# EAGLE design protoplank (EAGLE 6.2)
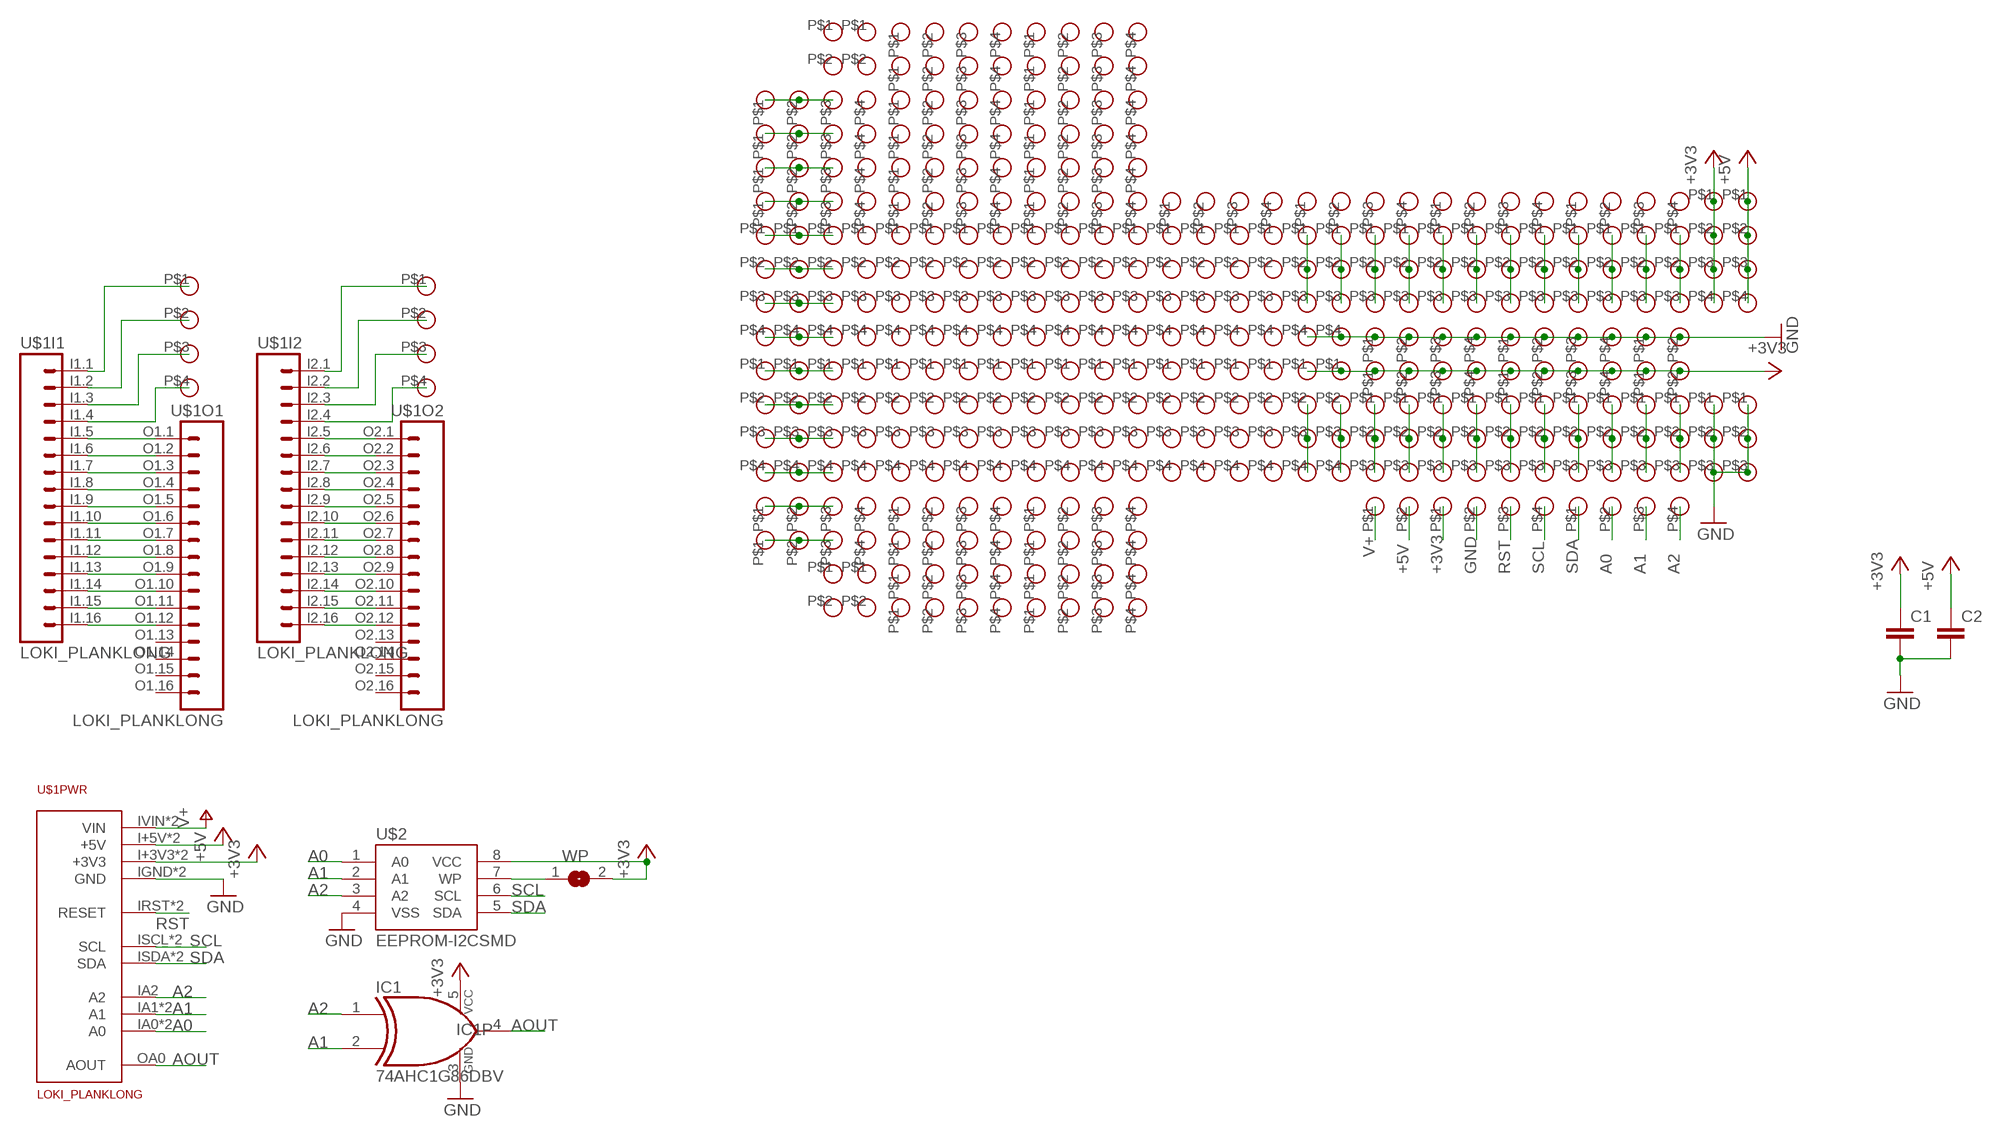
[diagram p0: schematic, sheet 1]

## Parts
C1  CAPPTH  [CAP-PTH-SMALL]
C2  CAPPTH  [CAP-PTH-SMALL]
IC1  74AHC1G86DBV  [SOT23-5]
U$1  LOKI_PLANKLONG  [PLANK_LONG]
U$2  EEPROM-I2CSMD  [SO08]
U$3  PROTOPAD-3  [PROTOPAD-3]
U$4  PROTOPAD-3  [PROTOPAD-3]
U$5  PROTOPAD-3  [PROTOPAD-3]
U$6  PROTOPAD-3  [PROTOPAD-3]
U$7  PROTOPAD-3  [PROTOPAD-3]
U$8  PROTOPAD-3  [PROTOPAD-3]
U$9  PROTOPAD-3  [PROTOPAD-3]
U$10  PROTOPAD-3  [PROTOPAD-3]
U$11  PROTOPAD-3  [PROTOPAD-3]
U$12  PROTOPAD-3  [PROTOPAD-3]
U$13  PROTOPAD-3  [PROTOPAD-3]
U$14  PROTOPAD-3  [PROTOPAD-3]
U$15  PROTOPAD-3  [PROTOPAD-3]
U$16  PROTOPAD-3  [PROTOPAD-3]
U$17  PROTOPAD-3  [PROTOPAD-3]
U$18  PROTOPAD-3  [PROTOPAD-3]
U$19  PROTOPAD-3  [PROTOPAD-3]
U$20  PROTOPAD-3  [PROTOPAD-3]
U$21  PROTOPAD-3  [PROTOPAD-3]
U$22  PROTOPAD-3  [PROTOPAD-3]
U$23  PROTOPAD-4SQUARE  [PROTOPAD-4]
U$24  PROTOPAD-4SQUARE  [PROTOPAD-4]
U$25  PROTOPAD-4SQUARE  [PROTOPAD-4]
U$26  PROTOPAD-4SQUARE  [PROTOPAD-4]
U$27  PROTOPAD-2SQUARE  [PROTOPAD-2]
U$28  PROTOPAD-2SQUARE  [PROTOPAD-2]
U$29  PROTOPAD-4ROUND  [PROTOPAD-4-ROUND]
U$30  PROTOPAD-4ROUND  [PROTOPAD-4-ROUND]
U$31  PROTOPAD-4ROUND  [PROTOPAD-4-ROUND]
U$32  PROTOPAD-4ROUND  [PROTOPAD-4-ROUND]
U$33  PROTOPAD-2ROUND  [PROTOPAD-2-ROUND]
U$34  PROTOPAD-4SQUARE  [PROTOPAD-4]
U$35  PROTOPAD-4SQUARE  [PROTOPAD-4]
U$36  PROTOPAD-4SQUARE  [PROTOPAD-4]
U$37  PROTOPAD-4SQUARE  [PROTOPAD-4]
U$38  PROTOPAD-4SQUARE  [PROTOPAD-4]
U$39  PROTOPAD-4SQUARE  [PROTOPAD-4]
U$40  PROTOPAD-4SQUARE  [PROTOPAD-4]
U$41  PROTOPAD-4SQUARE  [PROTOPAD-4]
U$42  PROTOPAD-4SQUARE  [PROTOPAD-4]
U$43  PROTOPAD-4SQUARE  [PROTOPAD-4]
U$44  PROTOPAD-4SQUARE  [PROTOPAD-4]
U$45  PROTOPAD-4SQUARE  [PROTOPAD-4]
U$46  PROTOPAD-4SQUARE  [PROTOPAD-4]
U$47  PROTOPAD-4SQUARE  [PROTOPAD-4]
U$48  PROTOPAD-4SQUARE  [PROTOPAD-4]
U$49  PROTOPAD-4SQUARE  [PROTOPAD-4]
U$50  PROTOPAD-4SQUARE  [PROTOPAD-4]
U$51  PROTOPAD-4SQUARE  [PROTOPAD-4]
U$52  PROTOPAD-4SQUARE  [PROTOPAD-4]
U$53  PROTOPAD-4SQUARE  [PROTOPAD-4]
U$54  PROTOPAD-4SQUARE  [PROTOPAD-4]
U$55  PROTOPAD-4SQUARE  [PROTOPAD-4]
U$56  PROTOPAD-4SQUARE  [PROTOPAD-4]
U$57  PROTOPAD-4SQUARE  [PROTOPAD-4]
U$58  PROTOPAD-4SQUARE  [PROTOPAD-4]
U$59  PROTOPAD-4SQUARE  [PROTOPAD-4]
U$60  PROTOPAD-4SQUARE  [PROTOPAD-4]
U$61  PROTOPAD-4SQUARE  [PROTOPAD-4]
U$62  PROTOPAD-4SQUARE  [PROTOPAD-4]
U$63  PROTOPAD-4SQUARE  [PROTOPAD-4]
U$64  PROTOPAD-4SQUARE  [PROTOPAD-4]
U$65  PROTOPAD-4SQUARE  [PROTOPAD-4]
U$66  PROTOPAD-4SQUARE  [PROTOPAD-4]
U$67  PROTOPAD-4SQUARE  [PROTOPAD-4]
U$68  PROTOPAD-4SQUARE  [PROTOPAD-4]
U$69  PROTOPAD-4SQUARE  [PROTOPAD-4]
U$70  PROTOPAD-4SQUARE  [PROTOPAD-4]
U$71  PROTOPAD-4SQUARE  [PROTOPAD-4]
U$72  PROTOPAD-4SQUARE  [PROTOPAD-4]
U$73  PROTOPAD-4SQUARE  [PROTOPAD-4]
U$74  PROTOPAD-4SQUARE  [PROTOPAD-4]
U$75  PROTOPAD-4SQUARE  [PROTOPAD-4]
U$76  PROTOPAD-4SQUARE  [PROTOPAD-4]
U$77  PROTOPAD-4SQUARE  [PROTOPAD-4]
U$78  PROTOPAD-3  [PROTOPAD-3]
U$79  PROTOPAD-4SQUARE  [PROTOPAD-4]
U$80  PROTOPAD-3  [PROTOPAD-3]
U$81  PROTOPAD-4SQUARE  [PROTOPAD-4]
U$82  PROTOPAD-4SQUARE  [PROTOPAD-4]
U$83  PROTOPAD-4SQUARE  [PROTOPAD-4]
U$84  PROTOPAD-4SQUARE  [PROTOPAD-4]
U$85  PROTOPAD-4SQUARE  [PROTOPAD-4]
U$86  PROTOPAD-4SQUARE  [PROTOPAD-4]
U$87  PROTOPAD-4SQUARE  [PROTOPAD-4]
U$88  PROTOPAD-4SQUARE  [PROTOPAD-4]
U$89  PROTOPAD-4SQUARE  [PROTOPAD-4]
U$90  PROTOPAD-4SQUARE  [PROTOPAD-4]
U$91  PROTOPAD-4SQUARE  [PROTOPAD-4]
U$92  PROTOPAD-4SQUARE  [PROTOPAD-4]
U$93  PROTOPAD-4SQUARE  [PROTOPAD-4]
U$94  PROTOPAD-4SQUARE  [PROTOPAD-4]
U$95  PROTOPAD-4SQUARE  [PROTOPAD-4]
U$96  PROTOPAD-4SQUARE  [PROTOPAD-4]
U$97  PROTOPAD-4SQUARE  [PROTOPAD-4]
U$98  PROTOPAD-4SQUARE  [PROTOPAD-4]
U$99  PROTOPAD-4SQUARE  [PROTOPAD-4]
U$100  PROTOPAD-4SQUARE  [PROTOPAD-4]
U$101  PROTOPAD-4SQUARE  [PROTOPAD-4]
U$102  PROTOPAD-4SQUARE  [PROTOPAD-4]
U$103  PROTOPAD-4SQUARE  [PROTOPAD-4]
U$104  PROTOPAD-2SQUARE  [PROTOPAD-2]
U$105  PROTOPAD-2SQUARE  [PROTOPAD-2]
U$106  PROTOPAD-2SQUARE  [PROTOPAD-2]
U$107  PROTOPAD-2SQUARE  [PROTOPAD-2]
WP  SJ  [SJ]

## Nets
+3V3: C1.1 IC1.5(VCC) U$1.I+3V3(PWR:+3V3) U$1.O+3V3(PWR:+3V3) U$2.8(VCC) U$25.P$1 U$25.P$2 U$25.P$3 U$25.P$4 U$26.P$1 U$26.P$2 U$26.P$3 U$26.P$4 U$28.P$1 U$28.P$2 U$32.P$1 U$35.P$1 U$36.P$1 U$77.P$1 U$77.P$2 U$77.P$3 U$77.P$4 WP.2
+5V: C2.1 U$1.I+5V(PWR:+5V) U$1.O+5V(PWR:+5V) U$33.P$2 U$79.P$1 U$79.P$2 U$79.P$3 U$79.P$4
A0: U$1.IA0(PWR:A0) U$1.OA1(PWR:A0) U$2.1(A0) U$31.P$2
A1: IC1.2(I1) U$1.IA1(PWR:A1) U$1.OA2(PWR:A1) U$2.2(A1) U$31.P$3
A2: IC1.1(I0) U$1.IA2(PWR:A2) U$2.3(A2) U$31.P$4
AOUT: IC1.4(O) U$1.OA0(PWR:AOUT)
GND: C1.2 C2.2 IC1.3(GND) U$1.IGND(PWR:GND) U$1.OGND(PWR:GND) U$2.4(VSS) U$23.P$1 U$23.P$2 U$23.P$3 U$23.P$4 U$24.P$1 U$24.P$2 U$24.P$3 U$24.P$4 U$27.P$1 U$27.P$2 U$32.P$2 U$34.P$4 U$37.P$4 U$78.P$1 U$78.P$2 U$78.P$3 U$80.P$1 U$80.P$2 U$80.P$3
N$1: U$1.I1.16 U$1.O1.12
N$2: U$1.I1.15 U$1.O1.11
N$3: U$1.I1.14 U$1.O1.10
N$4: U$1.I1.13 U$1.O1.9
N$5: U$1.I1.12 U$1.O1.8
N$6: U$1.I1.11 U$1.O1.7
N$7: U$1.I1.10 U$1.O1.6
N$8: U$1.I1.9 U$1.O1.5
N$9: U$1.I1.8 U$1.O1.4
N$10: U$1.I1.7 U$1.O1.3
N$11: U$1.I1.6 U$1.O1.2
N$12: U$1.I1.5 U$1.O1.1
N$13: U$1.I2.16 U$1.O2.12
N$14: U$1.I2.15 U$1.O2.11
N$15: U$1.I2.14 U$1.O2.10
N$16: U$1.I2.13 U$1.O2.9
N$17: U$1.I2.12 U$1.O2.8
N$18: U$1.I2.11 U$1.O2.7
N$19: U$1.I2.10 U$1.O2.6
N$20: U$1.I2.9 U$1.O2.5
N$21: U$1.I2.8 U$1.O2.4
N$22: U$1.I2.7 U$1.O2.3
N$23: U$1.I2.6 U$1.O2.2
N$24: U$1.I2.5 U$1.O2.1
N$25: U$1.I1.4 U$29.P$4
N$26: U$1.I1.3 U$29.P$3
N$27: U$1.I1.2 U$29.P$2
N$28: U$1.I1.1 U$29.P$1
N$29: U$1.I2.4 U$30.P$4
N$30: U$1.I2.3 U$30.P$3
N$31: U$2.7(WP) WP.1
N$32: U$3.P$1 U$3.P$2 U$3.P$3
N$33: U$1.I2.2 U$30.P$2
N$34: U$1.I2.1 U$30.P$1
N$35: U$4.P$1 U$4.P$2 U$4.P$3
N$36: U$5.P$1 U$5.P$2 U$5.P$3
N$37: U$6.P$1 U$6.P$2 U$6.P$3
N$38: U$7.P$1 U$7.P$2 U$7.P$3
N$39: U$8.P$1 U$8.P$2 U$8.P$3
N$40: U$9.P$1 U$9.P$2 U$9.P$3
N$41: U$10.P$1 U$10.P$2 U$10.P$3
N$42: U$11.P$1 U$11.P$2 U$11.P$3
N$43: U$12.P$1 U$12.P$2 U$12.P$3
N$44: U$13.P$1 U$13.P$2 U$13.P$3
N$45: U$14.P$1 U$14.P$2 U$14.P$3
N$46: U$15.P$1 U$15.P$2 U$15.P$3
N$47: U$16.P$1 U$16.P$2 U$16.P$3
N$48: U$17.P$1 U$17.P$2 U$17.P$3
N$49: U$18.P$1 U$18.P$2 U$18.P$3
N$50: U$19.P$1 U$19.P$2 U$19.P$3
N$51: U$20.P$1 U$20.P$2 U$20.P$3
N$52: U$21.P$1 U$21.P$2 U$21.P$3
N$53: U$22.P$1 U$22.P$2 U$22.P$3
N$54: U$89.P$1 U$89.P$2 U$89.P$3
N$55: U$88.P$1 U$88.P$2 U$88.P$3
N$56: U$34.P$1 U$34.P$2 U$34.P$3
N$57: U$37.P$1 U$37.P$2 U$37.P$3
N$58: U$81.P$1 U$81.P$2 U$81.P$3
N$59: U$35.P$2 U$35.P$3 U$35.P$4
N$60: U$36.P$2 U$36.P$3 U$36.P$4
N$61: U$76.P$1 U$76.P$2 U$76.P$3
N$62: U$65.P$1 U$66.P$1 U$69.P$1
N$63: U$65.P$2 U$66.P$2 U$69.P$2
N$64: U$65.P$3 U$66.P$3 U$69.P$3
N$65: U$65.P$4 U$66.P$4 U$69.P$4
N$66: U$64.P$1 U$67.P$1 U$68.P$1
N$67: U$64.P$2 U$67.P$2 U$68.P$2
N$68: U$64.P$3 U$67.P$3 U$68.P$3
N$69: U$64.P$4 U$67.P$4 U$68.P$4
N$70: U$96.P$1 U$96.P$2 U$96.P$3
N$71: U$99.P$1 U$99.P$2 U$99.P$3
RST: U$1.IRST(PWR:RESET) U$1.ORST(PWR:RESET) U$32.P$3
SCL: U$1.ISCL(PWR:SCL) U$1.OSCL(PWR:SCL) U$2.6(SCL) U$32.P$4
SDA: U$1.ISDA(PWR:SDA) U$1.OSDA(PWR:SDA) U$2.5(SDA) U$31.P$1
V+: U$1.IVIN(PWR:VIN) U$1.OVIN(PWR:VIN) U$33.P$1
Unconnected: U$1.O1.13 U$1.O1.14 U$1.O1.15 U$1.O1.16 U$1.O2.13 U$1.O2.14 U$1.O2.15 U$1.O2.16 U$38.P$1 U$38.P$2 U$38.P$3 U$38.P$4 U$39.P$1 U$39.P$2 U$39.P$3 U$39.P$4 U$40.P$1 U$40.P$2 U$40.P$3 U$40.P$4 U$41.P$1 U$41.P$2 U$41.P$3 U$41.P$4 U$42.P$1 U$42.P$2 U$42.P$3 U$42.P$4 U$43.P$1 U$43.P$2 U$43.P$3 U$43.P$4 U$44.P$1 U$44.P$2 U$44.P$3 U$44.P$4 U$45.P$1 U$45.P$2 U$45.P$3 U$45.P$4 U$46.P$1 U$46.P$2 U$46.P$3 U$46.P$4 U$47.P$1 U$47.P$2 U$47.P$3 U$47.P$4 U$48.P$1 U$48.P$2 U$48.P$3 U$48.P$4 U$49.P$1 U$49.P$2 U$49.P$3 U$49.P$4 U$50.P$1 U$50.P$2 U$50.P$3 U$50.P$4 U$51.P$1 U$51.P$2 U$51.P$3 U$51.P$4 U$52.P$1 U$52.P$2 U$52.P$3 U$52.P$4 U$53.P$1 U$53.P$2 U$53.P$3 U$53.P$4 U$54.P$1 U$54.P$2 U$54.P$3 U$54.P$4 U$55.P$1 U$55.P$2 U$55.P$3 U$55.P$4 U$56.P$1 U$56.P$2 U$56.P$3 U$56.P$4 U$57.P$1 U$57.P$2 U$57.P$3 U$57.P$4 U$58.P$1 U$58.P$2 U$58.P$3 U$58.P$4 U$59.P$1 U$59.P$2 U$59.P$3 U$59.P$4 U$60.P$1 U$60.P$2 U$60.P$3 U$60.P$4 U$61.P$1 U$61.P$2 U$61.P$3 U$61.P$4 U$62.P$1 U$62.P$2 U$62.P$3 U$62.P$4 U$63.P$1 U$63.P$2 U$63.P$3 U$63.P$4 U$70.P$1 U$70.P$2 U$70.P$3 U$70.P$4 U$71.P$1 U$71.P$2 U$71.P$3 U$71.P$4 U$72.P$1 U$72.P$2 U$72.P$3 U$72.P$4 U$73.P$1 U$73.P$2 U$73.P$3 U$73.P$4 U$74.P$1 U$74.P$2 U$74.P$3 U$74.P$4 U$75.P$1 U$75.P$2 U$75.P$3 U$75.P$4 U$76.P$4 U$81.P$4 U$82.P$1 U$82.P$2 U$82.P$3 U$82.P$4 U$83.P$1 U$83.P$2 U$83.P$3 U$83.P$4 U$84.P$1 U$84.P$2 U$84.P$3 U$84.P$4 U$85.P$1 U$85.P$2 U$85.P$3 U$85.P$4 U$86.P$1 U$86.P$2 U$86.P$3 U$86.P$4 U$87.P$1 U$87.P$2 U$87.P$3 U$87.P$4 U$88.P$4 U$89.P$4 U$90.P$1 U$90.P$2 U$90.P$3 U$90.P$4 U$91.P$1 U$91.P$2 U$91.P$3 U$91.P$4 U$92.P$1 U$92.P$2 U$92.P$3 U$92.P$4 U$93.P$1 U$93.P$2 U$93.P$3 U$93.P$4 U$94.P$1 U$94.P$2 U$94.P$3 U$94.P$4 U$95.P$1 U$95.P$2 U$95.P$3 U$95.P$4 U$96.P$4 U$97.P$1 U$97.P$2 U$97.P$3 U$97.P$4 U$98.P$1 U$98.P$2 U$98.P$3 U$98.P$4 U$99.P$4 U$100.P$1 U$100.P$2 U$100.P$3 U$100.P$4 U$101.P$1 U$101.P$2 U$101.P$3 U$101.P$4 U$102.P$1 U$102.P$2 U$102.P$3 U$102.P$4 U$103.P$1 U$103.P$2 U$103.P$3 U$103.P$4 U$104.P$1 U$104.P$2 U$105.P$1 U$105.P$2 U$106.P$1 U$106.P$2 U$107.P$1 U$107.P$2

## Library data of the parts
C1 C2 = SparkFun-Passives:CAP: Capacitor Standard 0603 ceramic capacitor, and 0.1" leaded capacitor.
IC1 = 74xx-little-us:74*1G86: 2-input EXCLUSIV-OR gate
U$1 = loki:LOKI_PLANK
U$2 = SparkFun-DigitalIC:EEPROM-I2C: I2C EEPROM chips, 24LC256 (and others)
U$3-U$22 U$78 U$80 = nickparts:PROTOPAD-3
U$23-U$26 U$29-U$32 U$34-U$77 U$79 U$81-U$103 = nickparts:PROTOPAD-4
U$27 U$28 U$33 U$104-U$107 = nickparts:PROTOPAD-2
WP = jumper:SJ: SMD solder JUMPER

## Board
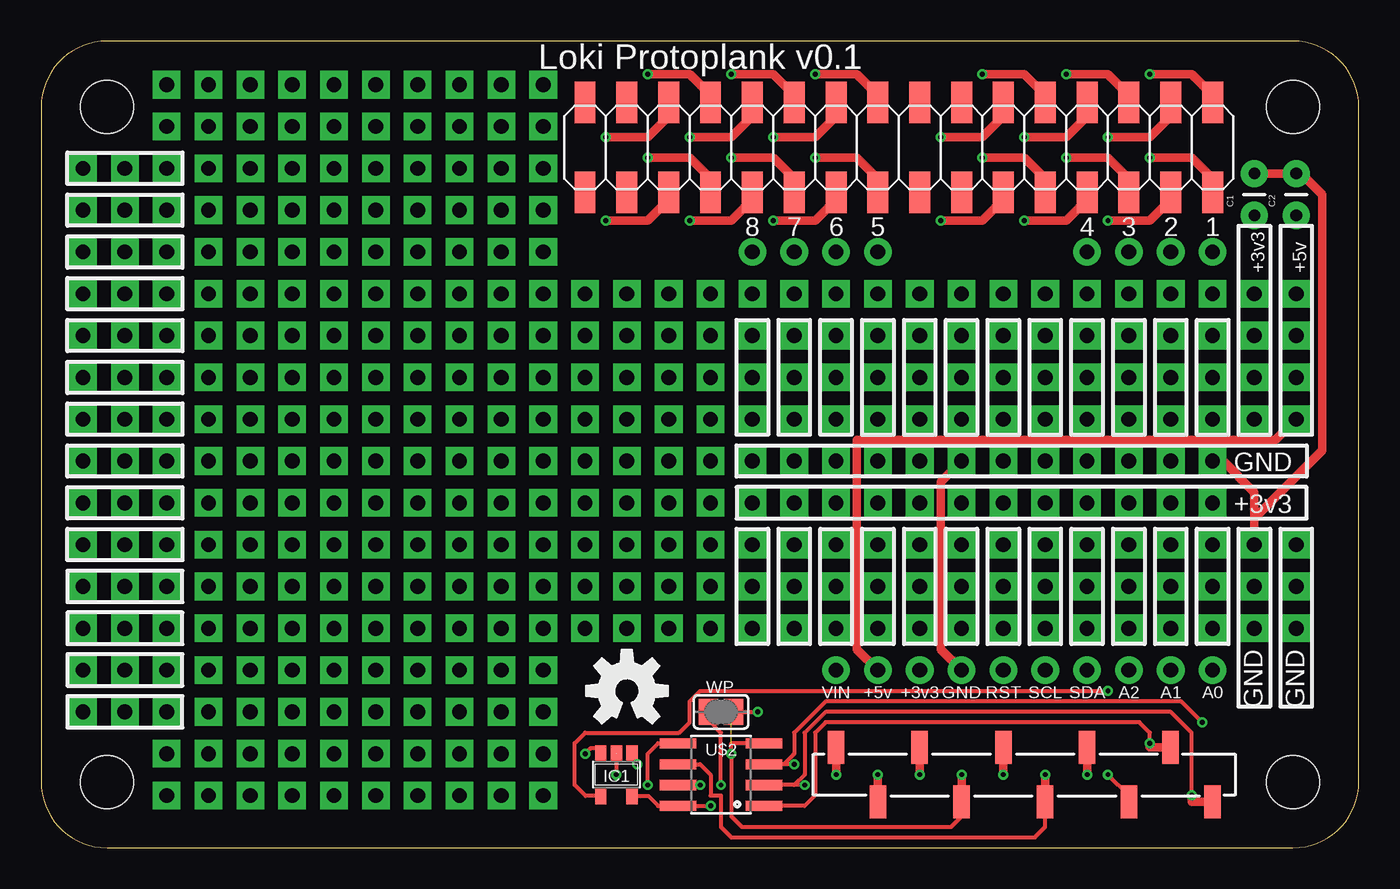
[diagram p1: board, top side]
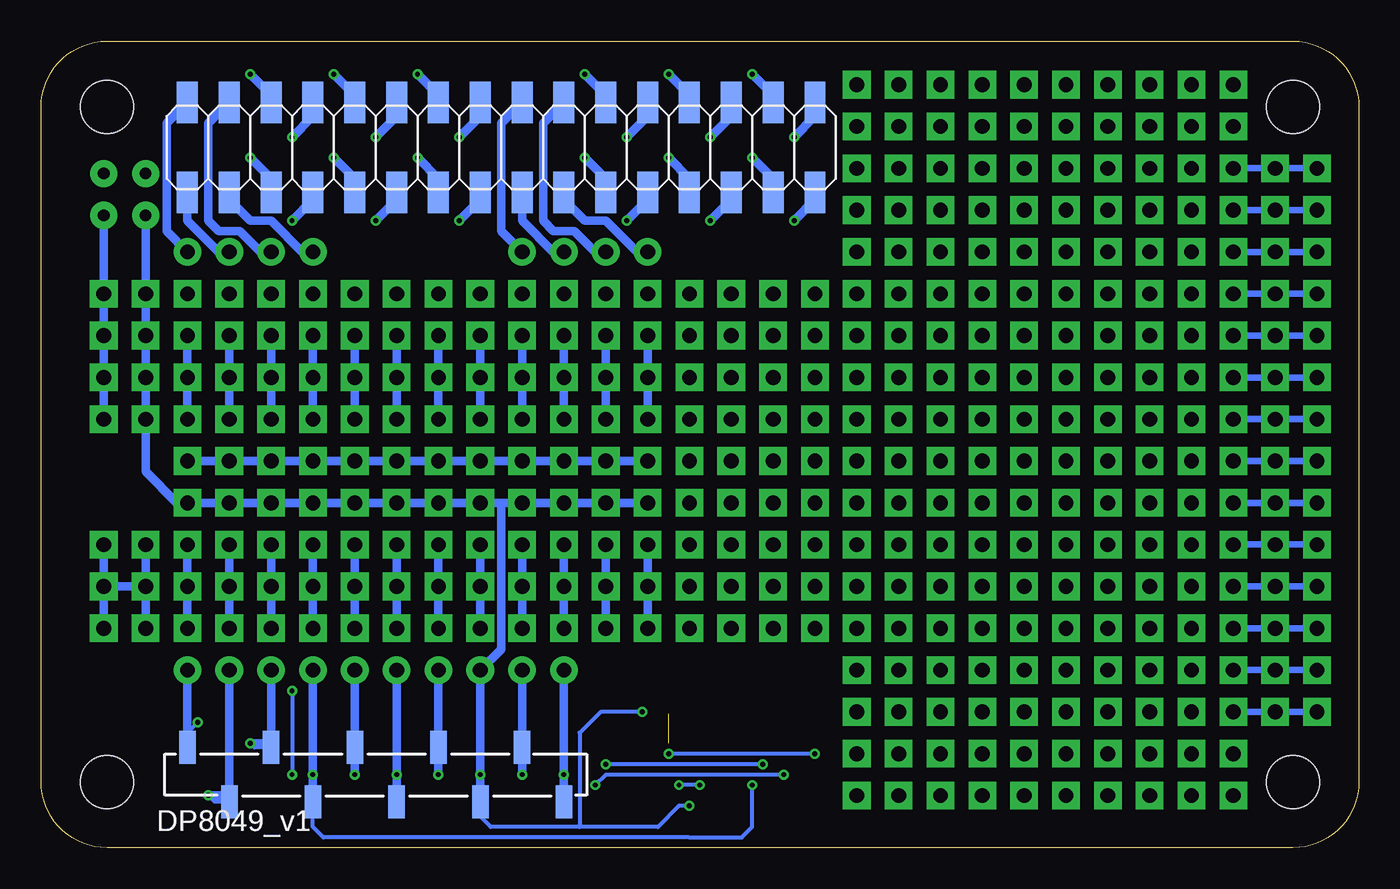
[diagram p2: board, bottom side, seen from below]

Size 80 x 49 mm. Coordinates in mm from the lower left corner, seen from the top.
Copper layers (1*16): Top 0.035mm / dielectric 1.5mm / Bottom 0.035mm
Design rules: minimum track width 6mil, minimum drill 0.3mm, track to track 6mil, track to pad 6mil, pad to pad 6mil, via to via 6mil, smd to smd 0mil, copper to edge 10mil, drill to drill 10mil, minimum pad ring 10mil, minimum via ring 6mil, stop-mask expansion 2mil, vias tented up to drill 100mil, thermal gap 10mil

### Footprints (pad centres in the part's own frame; a part is rotated, then mirrored left to right if it is on the bottom)
CAP-PTH-SMALL = drill 0.7 pad 1.651: 1 0,0; 2 2.54,0
SOT23-5 = smd 0.69 x 0.99: 1 -0.95,-1.29; 2 0,-1.29; 3 0.95,-1.29; 4 0.95,1.3; 5 -0.95,1.3
PLANK_LONG = smd 1.27 x 2.54 bottom: I1.1 71.12,45.275; I1.2 71.12,39.815; I1.3 68.58,45.275; I1.4 68.58,39.815; I1.5 66.04,45.275; I1.6 66.04,39.815; I1.7 63.5,45.275; I1.8 63.5,39.815; I1.9 60.96,45.275; I1.10 60.96,39.815; I1.11 58.42,45.275; I1.12 58.42,39.815; I1.13 55.88,45.275; I1.14 55.88,39.815; I1.15 53.34,45.275; I1.16 53.34,39.815; I2.1 50.8,45.275; I2.2 50.8,39.815; I2.3 48.26,45.275; I2.4 48.26,39.815; I2.5 45.72,45.275; I2.6 45.72,39.815; I2.7 43.18,45.275; I2.8 43.18,39.815; I2.9 40.64,45.275; I2.10 40.64,39.815; I2.11 38.1,45.275; I2.12 38.1,39.815; I2.13 35.56,45.275; I2.14 35.56,39.815; I2.15 33.02,45.275; I2.16 33.02,39.815 | smd 1 x 2 bottom: I+3V3 53.34,2.795; I+5V 50.8,6.095; IA0 66.04,6.095; IA1 68.58,2.795; IA2 71.12,6.095; IGND 55.88,6.095; IRST 58.42,2.795; ISCL 60.96,6.095; ISDA 63.5,2.795; IVIN 48.26,2.795 | smd 1.27 x 2.54: O1.1 71.12,45.275; O1.2 71.12,39.815; O1.3 68.58,45.275; O1.4 68.58,39.815; O1.5 66.04,45.275; O1.6 66.04,39.815; O1.7 63.5,45.275; O1.8 63.5,39.815; O1.9 60.96,45.275; O1.10 60.96,39.815; O1.11 58.42,45.275; O1.12 58.42,39.815; O1.13 55.88,45.275; O1.14 55.88,39.815; O1.15 53.34,45.275; O1.16 53.34,39.815; O2.1 50.8,45.275; O2.2 50.8,39.815; O2.3 48.26,45.275; O2.4 48.26,39.815; O2.5 45.72,45.275; O2.6 45.72,39.815; O2.7 43.18,45.275; O2.8 43.18,39.815; O2.9 40.64,45.275; O2.10 40.64,39.815; O2.11 38.1,45.275; O2.12 38.1,39.815; O2.13 35.56,45.275; O2.14 35.56,39.815; O2.15 33.02,45.275; O2.16 33.02,39.815 | smd 1 x 2: O+3V3 53.34,6.095; O+5V 50.8,2.795; OA0 66.04,2.795; OA1 68.58,6.095; OA2 71.12,2.795; OGND 55.88,2.795; ORST 58.42,6.095; OSCL 60.96,2.795; OSDA 63.5,6.095; OVIN 48.26,6.095 | hole 3.2: 4,4; 76,4; 76,45; 4,45
SO08 = smd 0.61 x 2.21: 1 -1.905,-2.616; 2 -0.635,-2.616; 3 0.635,-2.616; 4 1.905,-2.616; 5 1.905,2.616; 6 0.635,2.616; 7 -0.635,2.616; 8 -1.905,2.616
PROTOPAD-3 = drill 0.9 pad 1.676 square: P$1 0,2.54; P$2 0,0; P$3 0,-2.54
PROTOPAD-4 = drill 0.9 pad 1.676 square: P$1 0,3.81; P$2 0,1.27; P$3 0,-1.27; P$4 0,-3.81
PROTOPAD-2 = drill 0.9 pad 1.676 square: P$1 0,1.27; P$2 0,-1.27
PROTOPAD-4-ROUND = drill 0.9 pad 1.676: P$1 0,3.81; P$2 0,1.27; P$3 0,-1.27; P$4 0,-3.81
PROTOPAD-2-ROUND = drill 0.9 pad 1.676: P$1 0,1.27; P$2 0,-1.27
SJ = smd 1.168 x 1.6: 1 -0.762,0; 2 0.762,0

### Placement (x,y rotation side)
C1  73.66,38.42 90 top
C2  76.2,38.42 90 top
IC1  34.92,4.45 180 top
U$1  0,0 0 top
U$2  41.27,4.45 90 top
U$3  48.26,28.57 0 top
U$4  50.8,28.57 0 top
U$5  53.34,28.57 0 top
U$6  55.88,28.57 0 top
U$7  58.42,28.57 0 top
U$8  60.96,28.57 0 top
U$9  63.5,28.57 0 top
U$10  66.04,28.57 0 top
U$11  68.58,28.57 0 top
U$12  71.12,28.57 0 top
U$13  48.26,15.88 0 top
U$14  50.8,15.88 0 top
U$15  53.34,15.88 0 top
U$16  55.88,15.88 0 top
U$17  58.42,15.88 0 top
U$18  60.96,15.88 0 top
U$19  63.5,15.88 0 top
U$20  66.04,15.88 0 top
U$21  68.58,15.88 0 top
U$22  71.12,15.88 0 top
U$23  52.07,23.5 90 top
U$24  62.23,23.5 90 top
U$25  52.07,20.95 90 top
U$26  62.23,20.95 90 top
U$27  69.85,23.5 90 top
U$28  69.85,20.95 90 top
U$29  67.31,36.2 270 top
U$30  46.99,36.2 270 top
U$31  67.31,10.79 90 top
U$32  57.15,10.79 90 top
U$33  49.53,10.79 90 top
U$34  45.72,27.3 0 top
U$35  45.72,17.14 0 top
U$36  43.18,17.14 0 top
U$37  43.18,27.3 0 top
U$38  40.64,27.3 0 top
U$39  40.64,17.14 0 top
U$40  38.1,27.3 0 top
U$41  38.1,17.14 0 top
U$42  35.56,27.3 0 top
U$43  35.56,17.14 0 top
U$44  33.02,27.3 0 top
U$45  33.02,17.14 0 top
U$46  30.48,27.3 0 top
U$47  30.48,17.14 0 top
U$48  27.94,27.3 0 top
U$49  27.94,17.14 0 top
U$50  25.4,27.3 0 top
U$51  25.4,17.14 0 top
U$52  22.86,27.3 0 top
U$53  22.86,17.14 0 top
U$54  20.32,27.3 0 top
U$55  20.32,17.14 0 top
U$56  17.78,27.3 0 top
U$57  17.78,17.14 0 top
U$58  12.7,17.14 0 top
U$59  10.16,17.14 0 top
U$60  10.16,27.3 0 top
U$61  12.7,27.3 0 top
U$62  15.24,27.3 0 top
U$63  15.24,17.14 0 top
U$64  2.54,17.14 0 top
U$65  7.62,27.3 0 top
U$66  5.08,27.3 0 top
U$67  5.08,17.14 0 top
U$68  7.62,17.14 0 top
U$69  2.54,27.3 0 top
U$70  67.31,33.66 90 top
U$71  57.15,33.66 90 top
U$72  46.99,33.66 90 top
U$73  36.83,33.66 90 top
U$74  26.67,33.66 90 top
U$75  16.51,33.66 90 top
U$76  6.35,33.66 90 top
U$77  73.66,29.84 0 top
U$78  73.66,15.88 0 top
U$79  76.2,29.84 0 top
U$80  76.2,15.88 0 top
U$81  6.35,36.2 90 top
U$82  16.51,36.2 90 top
U$83  26.67,36.2 90 top
U$84  16.51,41.27 90 top
U$85  16.51,38.73 90 top
U$86  26.67,38.73 90 top
U$87  26.67,41.27 90 top
U$88  6.35,38.73 90 top
U$89  6.35,41.27 90 top
U$90  16.51,3.17 90 top
U$91  16.51,10.79 90 top
U$92  26.67,10.79 90 top
U$93  26.67,5.71 90 top
U$94  16.51,8.26 90 top
U$95  26.67,8.26 90 top
U$96  6.35,8.26 90 top
U$97  16.51,5.71 90 top
U$98  26.67,3.17 90 top
U$99  6.35,10.79 90 top
U$100  26.67,43.81 90 top
U$101  16.51,43.81 90 top
U$102  26.67,46.35 90 top
U$103  16.51,46.35 90 top
U$104  10.16,45.09 0 top
U$105  10.16,4.45 0 top
U$106  7.62,4.45 0 top
U$107  7.62,45.09 0 top
U$108  [OSHW-LOGO-M]  35.56,9.53 0 top
WP  41.27,8.26 0 top

### Tracks (layer width: path | path; a pad name or v marks a point on that pad's centre or on a via)
+3V3  (via drill 0.3)
  Top 0.254: v40.64,2.54 U$2.8 37.46,2.54 36.86,3.15 IC1.5 | WP.2 v43.5,8.26
  Top 0.508: U$1.O+3V3 v53.34,4.45
  Bottom 0.254: v40.64,2.54 41.27,2.54 42.54,1.27 47.31,1.27 | 47.31,1.27 52.7,1.27 53.34,1.91 U$1.I+3V3 | v43.5,8.26 46.04,8.26 47.31,6.99 47.31,1.27
  Bottom 0.508: v53.34,4.45 53.34,3.81 | 53.34,3.81 U$1.I+3V3 | 53.34,3.81 U$32.P$1 52.07,12.06 52.07,20.95 | 52.07,20.95 U$25.P$2 U$25.P$1 U$35.P$1 U$36.P$1 | 52.07,20.95 U$25.P$3 U$25.P$4 U$26.P$1 U$26.P$2 U$26.P$3 U$26.P$4 U$28.P$1 U$28.P$2 71.76,20.95 73.66,22.86 U$77.P$4 U$77.P$3 U$77.P$2 U$77.P$1 C1.1
+5V  (via drill 0.3)
  Top 0.508: v50.8,4.45 U$1.O+5V | U$79.P$4 74.93,24.77 50.16,24.77 49.53,24.77 49.53,24.13 49.53,12.06 U$33.P$2
  Bottom 0.508: U$1.I+5V 50.8,5.08 | 50.8,5.08 v50.8,4.45 | U$33.P$2 50.8,5.08 | U$79.P$4 U$79.P$3 U$79.P$2 U$79.P$1 C2.1
A0  (via drill 0.3)
  Top 0.254: v67.31,6.35 67.31,6.99 66.67,7.62 47.62,7.62 46.99,6.99 46.99,3.17 46.35,2.54 U$2.1
  Top 0.508: U$1.OA1 67.31,6.09 v67.31,6.35
  Bottom 0.254: U$1.IA0 67.06,6.09 v67.31,6.35
  Bottom 0.508: v67.31,6.35 66.04,6.35 U$1.IA0 U$31.P$2
A1  (via drill 0.3)
  Top 0.254: v69.85,3.17 69.85,6.99 68.58,8.26 47.62,8.26 46.35,6.99 46.35,4.45 45.72,3.81 U$2.2 v46.35,3.81 | IC1.2 v34.92,4.45
  Top 0.508: U$1.OA2 69.85,2.79 v69.85,3.17
  Bottom 0.254: U$1.IA1 69.47,2.79 v69.85,3.17 | v34.92,4.45 45.72,4.45 v46.35,3.81
  Bottom 0.508: v69.85,3.17 68.58,3.17 U$1.IA1 U$31.P$3
A2  (via drill 0.3)
  Top 0.254: v70.48,7.62 69.22,8.89 47.62,8.89 45.72,6.99 45.72,5.71 45.08,5.08 U$2.3 v45.72,5.08 | IC1.1 35.88,5.4 v36.2,5.08
  Bottom 0.254: U$1.IA2 71.12,6.35 71.12,6.99 v70.48,7.62 | v36.2,5.08 v45.72,5.08
  Bottom 0.508: U$31.P$4 U$1.IA2
AOUT  (via drill 0.3)
  Top 0.254: IC1.4 33.05,3.15 32.38,3.81 32.38,6.35 33.02,6.99 38.73,6.99 39.37,7.62 39.37,8.89 40,9.53 v64.77,9.53 | v64.77,4.45 66.04,3.17 U$1.OA0
  Bottom 0.254: v64.77,9.53 v64.77,4.45
GND  (via drill 0.3)  (1 unrouted)
  Top 0.254: v41.91,5.71 41.91,1.91 42.54,1.27 55.24,1.27 55.88,1.91 U$1.OGND | IC1.3 33.97,6.04 33.34,6.04 v33.02,5.71 | v41.91,5.71 41.91,6.35 | U$2.4 41.91,6.35 | v41.91,5.71 41.91,6.35
  Top 0.508: v55.88,4.45 U$1.OGND | U$32.P$2 54.61,12.06 54.61,22.23 U$23.P$4 | U$27.P$2 71.76,23.5 73.66,21.59 73.66,20 | 73.66,20 U$78.P$1 | 73.66,20 77.79,24.13 77.79,39.69 76.52,40.96 C2.2 C1.2
  Bottom 0.254: v33.02,5.71 v41.91,5.71
  Bottom 0.508: U$1.IGND 55.88,5.08 | 55.88,5.08 v55.88,4.45 | U$32.P$2 55.88,5.08 | U$27.P$2 U$27.P$1 U$24.P$4 U$24.P$3 U$24.P$2 U$24.P$1 U$23.P$4 U$23.P$3 U$23.P$2 U$23.P$1 U$34.P$4 U$37.P$4 | U$80.P$3 U$80.P$2 | U$80.P$2 U$80.P$1 | U$78.P$3 U$78.P$2 | U$78.P$2 U$78.P$1 | U$80.P$2 U$78.P$2
N$1  (via drill 0.3)
  Top 0.508: U$1.O1.12 58.42,39.37 57.15,38.1 v54.61,38.1
  Bottom 0.508: v54.61,38.1 53.34,39.37 U$1.I1.16
N$2  (via drill 0.3)
  Top 0.508: U$1.O1.11 58.42,44.45 57.15,43.18 v54.61,43.18
  Bottom 0.508: v54.61,43.18 53.34,44.45 U$1.I1.15
N$3  (via drill 0.3)
  Top 0.508: U$1.O1.10 60.96,40.64 59.69,41.91 v57.15,41.91
  Bottom 0.508: v57.15,41.91 55.88,40.64 U$1.I1.14
N$4  (via drill 0.3)
  Top 0.508: U$1.O1.9 60.96,45.72 59.69,46.99 v57.15,46.99
  Bottom 0.508: v57.15,46.99 55.88,45.72 U$1.I1.13
N$5  (via drill 0.3)
  Top 0.508: U$1.O1.8 63.5,39.37 62.23,38.1 v59.69,38.1
  Bottom 0.508: v59.69,38.1 58.42,39.37 U$1.I1.12
N$6  (via drill 0.3)
  Top 0.508: U$1.O1.7 63.5,44.45 62.23,43.18 v59.69,43.18
  Bottom 0.508: v59.69,43.18 58.42,44.45 U$1.I1.11
N$7  (via drill 0.3)
  Top 0.508: U$1.O1.6 66.04,40.64 64.77,41.91 v62.23,41.91
  Bottom 0.508: v62.23,41.91 60.96,40.64 U$1.I1.10
N$8  (via drill 0.3)
  Top 0.508: U$1.O1.5 66.04,45.72 64.77,46.99 v62.23,46.99
  Bottom 0.508: v62.23,46.99 60.96,45.72 U$1.I1.9
N$9  (via drill 0.3)
  Top 0.508: U$1.O1.4 68.58,39.37 67.31,38.1 v64.77,38.1
  Bottom 0.508: v64.77,38.1 63.5,39.37 U$1.I1.8
N$10  (via drill 0.3)
  Top 0.508: U$1.O1.3 68.58,44.45 67.31,43.18 v64.77,43.18
  Bottom 0.508: v64.77,43.18 63.5,44.45 U$1.I1.7
N$11  (via drill 0.3)
  Top 0.508: U$1.O1.2 71.12,40.64 69.85,41.91 v67.31,41.91
  Bottom 0.508: v67.31,41.91 66.04,40.64 U$1.I1.6
N$12  (via drill 0.3)
  Top 0.508: U$1.O1.1 71.12,45.72 69.85,46.99 v67.31,46.99
  Bottom 0.508: v67.31,46.99 66.04,45.72 U$1.I1.5
N$13  (via drill 0.3)
  Top 0.508: U$1.O2.12 38.1,39.37 36.83,38.1 v34.29,38.1
  Bottom 0.508: v34.29,38.1 33.02,39.37 U$1.I2.16
N$14  (via drill 0.3)
  Top 0.508: U$1.O2.11 38.1,44.45 36.83,43.18 v34.29,43.18
  Bottom 0.508: v34.29,43.18 33.02,44.45 U$1.I2.15
N$15  (via drill 0.3)
  Top 0.508: U$1.O2.10 40.64,40.64 39.37,41.91 v36.83,41.91
  Bottom 0.508: v36.83,41.91 35.56,40.64 U$1.I2.14
N$16  (via drill 0.3)
  Top 0.508: U$1.O2.9 40.64,45.72 39.37,46.99 v36.83,46.99
  Bottom 0.508: v36.83,46.99 35.56,45.72 U$1.I2.13
N$17  (via drill 0.3)
  Top 0.508: U$1.O2.8 43.18,39.37 41.91,38.1 v39.37,38.1
  Bottom 0.508: v39.37,38.1 38.1,39.37 U$1.I2.12
N$18  (via drill 0.3)
  Top 0.508: U$1.O2.7 43.18,44.45 41.91,43.18 v39.37,43.18
  Bottom 0.508: v39.37,43.18 38.1,44.45 U$1.I2.11
N$19  (via drill 0.3)
  Top 0.508: U$1.O2.6 45.72,40.64 44.45,41.91 v41.91,41.91
  Bottom 0.508: v41.91,41.91 40.64,40.64 U$1.I2.10
N$20  (via drill 0.3)
  Top 0.508: U$1.O2.5 45.72,45.72 44.45,46.99 v41.91,46.99
  Bottom 0.508: v41.91,46.99 40.64,45.72 U$1.I2.9
N$21  (via drill 0.3)
  Top 0.508: U$1.O2.4 48.26,39.37 46.99,38.1 v44.45,38.1
  Bottom 0.508: v44.45,38.1 43.18,39.37 U$1.I2.8
N$22  (via drill 0.3)
  Top 0.508: U$1.O2.3 48.26,44.45 46.99,43.18 v44.45,43.18
  Bottom 0.508: v44.45,43.18 43.18,44.45 U$1.I2.7
N$23  (via drill 0.3)
  Top 0.508: U$1.O2.2 50.8,40.64 49.53,41.91 v46.99,41.91
  Bottom 0.508: v46.99,41.91 45.72,40.64 U$1.I2.6
N$24  (via drill 0.3)
  Top 0.508: U$1.O2.1 50.8,45.72 49.53,46.99 v46.99,46.99
  Bottom 0.508: v46.99,46.99 45.72,45.72 U$1.I2.5
N$25
  Bottom 0.508: U$29.P$4 64.14,36.2 66.04,38.1 67.31,38.1 68.58,39.37 U$1.I1.4
N$26
  Bottom 0.508: U$29.P$3 66.67,36.2 67.95,37.47 69.22,37.47 69.85,38.1 69.85,44.01 U$1.I1.3
N$27
  Bottom 0.508: U$29.P$2 69.22,36.2 71.12,38.1 U$1.I1.2
N$28
  Bottom 0.508: U$29.P$1 72.39,37.47 72.39,44.01 U$1.I1.1
N$29
  Bottom 0.508: U$1.I2.4 48.26,39.37 46.99,38.1 45.72,38.1 43.81,36.2 U$30.P$4
N$30
  Bottom 0.508: U$30.P$3 46.35,36.2 47.62,37.47 48.89,37.47 49.53,38.1 49.53,44.01 U$1.I2.3
N$31  (via drill 0.3)
  Top 0.254: U$2.7 v40,3.81 | v41.27,3.81 41.27,6.99 40.64,7.62 40.64,8.13 WP.1
  Bottom 0.254: v40,3.81 v41.27,3.81
N$32
  Bottom 0.508: U$3.P$1 U$3.P$2 U$3.P$3
N$33
  Bottom 0.508: U$30.P$2 48.89,36.2 50.8,38.1 U$1.I2.2
N$34
  Bottom 0.508: U$30.P$1 52.07,37.47 52.07,44.01 U$1.I2.1
N$35
  Bottom 0.508: U$4.P$1 U$4.P$2 U$4.P$3
N$36
  Bottom 0.508: U$5.P$1 U$5.P$2 U$5.P$3
N$37
  Bottom 0.508: U$6.P$1 U$6.P$2 U$6.P$3
N$38
  Bottom 0.508: U$7.P$1 U$7.P$2 U$7.P$3
N$39
  Bottom 0.508: U$8.P$1 U$8.P$2 U$8.P$3
N$40
  Bottom 0.508: U$9.P$1 U$9.P$2 U$9.P$3
N$41
  Bottom 0.508: U$10.P$1 U$10.P$2 U$10.P$3
N$42
  Bottom 0.508: U$11.P$1 U$11.P$2 U$11.P$3
N$43
  Bottom 0.508: U$12.P$1 U$12.P$2 U$12.P$3
N$44
  Bottom 0.508: U$13.P$1 U$13.P$2 U$13.P$3
N$45
  Bottom 0.508: U$14.P$1 U$14.P$2 U$14.P$3
N$46
  Bottom 0.508: U$15.P$1 U$15.P$2 U$15.P$3
N$47
  Bottom 0.508: U$16.P$1 U$16.P$2 U$16.P$3
N$48
  Bottom 0.508: U$17.P$1 U$17.P$2 U$17.P$3
N$49
  Bottom 0.508: U$18.P$1 U$18.P$2 U$18.P$3
N$50
  Bottom 0.508: U$19.P$1 U$19.P$2 U$19.P$3
N$51
  Bottom 0.508: U$20.P$1 U$20.P$2 U$20.P$3
N$52
  Bottom 0.508: U$21.P$1 U$21.P$2 U$21.P$3
N$53
  Bottom 0.508: U$22.P$1 U$22.P$2 U$22.P$3
N$54
  Bottom 0.406: U$89.P$1 U$89.P$2 U$89.P$3
N$55
  Bottom 0.406: U$88.P$3 U$88.P$2 U$88.P$1
N$56
  Bottom 0.508: U$34.P$3 U$34.P$2 U$34.P$1
N$57
  Bottom 0.508: U$37.P$1 U$37.P$2 U$37.P$3
N$58
  Bottom 0.406: U$81.P$1 U$81.P$2 U$81.P$3
N$59
  Bottom 0.508: U$35.P$2 U$35.P$3 U$35.P$4
N$60
  Bottom 0.508: U$36.P$4 U$36.P$3 U$36.P$2
N$61
  Bottom 0.406: U$76.P$1 U$76.P$2 U$76.P$3
N$62
  Bottom 0.406: U$69.P$1 U$66.P$1 U$65.P$1
N$63
  Bottom 0.406: U$65.P$2 U$66.P$2 U$69.P$2
N$64
  Bottom 0.406: U$69.P$3 U$66.P$3 U$65.P$3
N$65
  Bottom 0.406: U$65.P$4 U$66.P$4 U$69.P$4
N$66
  Bottom 0.406: U$64.P$1 U$67.P$1 U$68.P$1
N$67
  Bottom 0.406: U$68.P$2 U$67.P$2 U$64.P$2
N$68
  Bottom 0.406: U$64.P$3 U$67.P$3 U$68.P$3
N$69
  Bottom 0.406: U$68.P$4 U$67.P$4 U$64.P$4
N$70
  Bottom 0.406: U$96.P$3 U$96.P$2 U$96.P$1
N$71
  Bottom 0.406: U$99.P$1 U$99.P$2 U$99.P$3
RST  (via drill 0.3)
  Top 0.508: U$1.ORST v58.42,4.45
  Bottom 0.508: v58.42,4.45 58.42,3.81 | 58.42,3.81 U$1.IRST | U$32.P$3 58.42,3.81
SCL  (via drill 0.3)
  Top 0.254: U$2.6 40,5.08 40.64,4.45 40.64,3.17 41.27,3.17 41.27,1.27 41.91,0.64 42.54,0.64 60.32,0.64 60.96,1.27 U$1.OSCL
  Top 0.508: v60.96,4.45 U$1.OSCL
  Bottom 0.508: U$1.ISCL 60.96,5.08 | 60.96,5.08 v60.96,4.45 | U$32.P$4 60.96,5.08
SDA  (via drill 0.3)
  Top 0.254: v36.83,3.81 36.83,5.71 37.46,6.35 U$2.5
  Top 0.508: U$1.OSDA v63.5,4.45
  Bottom 0.254: U$1.ISDA 63.5,1.27 62.87,0.64 40.64,0.64 37.46,0.64 36.83,1.27 v36.83,3.81
  Bottom 0.508: v63.5,4.45 63.5,3.81 | 63.5,3.81 U$1.ISDA | U$31.P$1 63.5,5.08 63.5,3.81
V+  (via drill 0.3)
  Top 0.508: U$1.OVIN v48.26,4.45
  Bottom 0.508: v48.26,4.45 48.26,3.81 | 48.26,3.81 U$1.IVIN | U$33.P$1 48.26,3.81

### Text on the board
tPlace: Loki Protoplank v0.1 | 8 | 7 | 6 | 5 | 4 | 3 | 2 | 1 | +3v3 | +5v | GND | +3v3 | GND | GND | VIN | +5v | +3v3 | GND | RST | SCL | SDA | A2 | A1 | A0